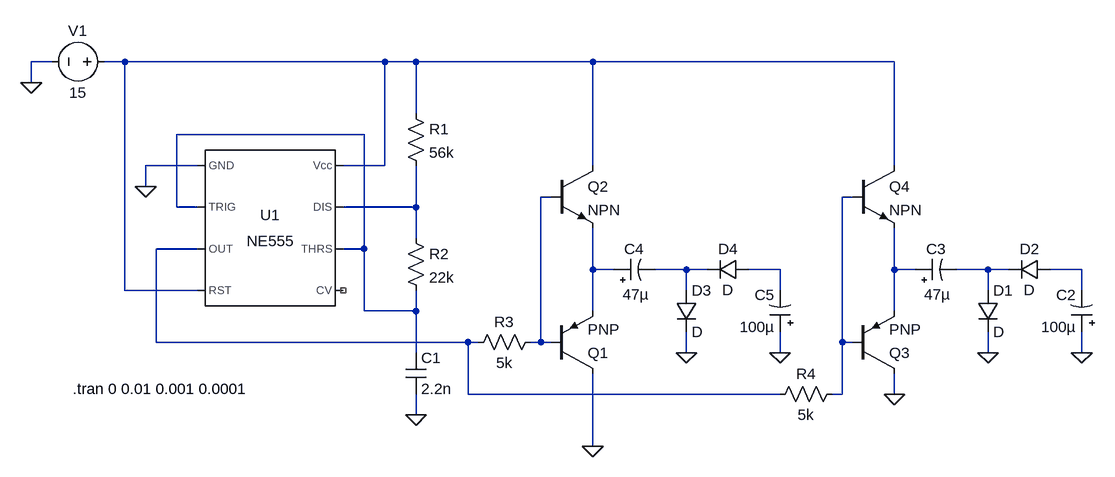
[diagram p0: schematic 555timer_voltageInerter_ChargePump_2.asc]
555timer_voltageInerter_ChargePump_2.asc, the LTspice schematic file:
Version 4
SHEET 1 1700 680
WIRE -224 -96 -256 -96
WIRE -112 -96 -144 -96
WIRE 288 -96 -112 -96
WIRE 336 -96 288 -96
WIRE 608 -96 336 -96
WIRE 1072 -96 608 -96
WIRE -256 -64 -256 -96
WIRE 336 -16 336 -96
WIRE 256 16 -32 16
WIRE 0 64 -80 64
WIRE 288 64 288 -96
WIRE 288 64 224 64
WIRE 608 64 608 -96
WIRE 1072 64 1072 -96
WIRE -80 96 -80 64
WIRE 544 112 528 112
WIRE 1008 112 992 112
WIRE -32 128 -32 16
WIRE 0 128 -32 128
WIRE 336 128 336 64
WIRE 336 128 224 128
WIRE 336 176 336 128
WIRE 0 192 -64 192
WIRE 256 192 256 16
WIRE 256 192 224 192
WIRE 608 224 608 160
WIRE 640 224 608 224
WIRE 752 224 704 224
WIRE 784 224 752 224
WIRE 896 224 848 224
WIRE 1072 224 1072 160
WIRE 1104 224 1072 224
WIRE 1216 224 1168 224
WIRE 1248 224 1216 224
WIRE 1360 224 1312 224
WIRE -112 256 -112 -96
WIRE 0 256 -112 256
WIRE 752 256 752 224
WIRE 896 256 896 224
WIRE 1216 256 1216 224
WIRE 1360 256 1360 224
WIRE 256 288 256 192
WIRE 336 288 336 256
WIRE 336 288 256 288
WIRE 608 288 608 224
WIRE 1072 288 1072 224
WIRE -64 336 -64 192
WIRE 416 336 -64 336
WIRE 432 336 416 336
WIRE 528 336 528 112
WIRE 528 336 512 336
WIRE 544 336 528 336
WIRE 992 336 992 112
WIRE 1008 336 992 336
WIRE 336 352 336 288
WIRE 752 352 752 320
WIRE 896 352 896 320
WIRE 1216 352 1216 320
WIRE 1360 352 1360 320
WIRE 416 416 416 336
WIRE 896 416 416 416
WIRE 992 416 992 336
WIRE 992 416 976 416
WIRE 1072 416 1072 384
WIRE 336 448 336 416
WIRE 608 496 608 384
FLAG -80 96 0
FLAG -256 -64 0
FLAG 336 448 0
FLAG 1216 352 0
FLAG 1360 352 0
FLAG 752 352 0
FLAG 896 352 0
FLAG 608 496 0
FLAG 1072 416 0
SYMBOL Misc\\NE555 112 160 R0
SYMATTR InstName U1
SYMBOL voltage -128 -96 R90
WINDOW 0 -32 56 VBottom 2
WINDOW 3 32 56 VTop 2
WINDOW 123 0 0 Left 2
WINDOW 39 0 0 Left 2
SYMATTR InstName V1
SYMATTR Value 15
SYMBOL res 320 -32 R0
SYMATTR InstName R1
SYMATTR Value 56k
SYMBOL res 320 160 R0
SYMATTR InstName R2
SYMATTR Value 22k
SYMBOL cap 320 352 R0
SYMATTR InstName C1
SYMATTR Value 2.2n
SYMBOL polcap 1104 240 R270
WINDOW 0 32 32 VTop 2
WINDOW 3 -7 34 VBottom 2
SYMATTR InstName C3
SYMATTR Value 47µ
SYMATTR Description Capacitor
SYMATTR Type cap
SYMATTR SpiceLine V=25 Irms=210m Rser=0.55 Lser=0
SYMBOL diode 1200 256 R0
SYMATTR InstName D1
SYMBOL diode 1312 208 R90
WINDOW 0 0 32 VBottom 2
WINDOW 3 32 32 VTop 2
SYMATTR InstName D2
SYMBOL polcap 1376 320 R180
WINDOW 0 24 57 Left 2
WINDOW 3 24 8 Left 2
SYMATTR InstName C2
SYMATTR Value 100µ
SYMATTR Description Capacitor
SYMATTR Type cap
SYMATTR SpiceLine V=50 Irms=170m Rser=1 Lser=0
SYMBOL polcap 640 240 R270
WINDOW 0 32 32 VTop 2
WINDOW 3 -7 34 VBottom 2
SYMATTR InstName C4
SYMATTR Value 47µ
SYMATTR Description Capacitor
SYMATTR Type cap
SYMATTR SpiceLine V=25 Irms=210m Rser=0.55 Lser=0
SYMBOL diode 736 256 R0
SYMATTR InstName D3
SYMBOL diode 848 208 R90
WINDOW 0 0 32 VBottom 2
WINDOW 3 32 32 VTop 2
SYMATTR InstName D4
SYMBOL polcap 912 320 R180
WINDOW 0 24 57 Left 2
WINDOW 3 24 8 Left 2
SYMATTR InstName C5
SYMATTR Value 100µ
SYMATTR Description Capacitor
SYMATTR Type cap
SYMATTR SpiceLine V=50 Irms=170m Rser=1 Lser=0
SYMBOL pnp 544 384 M180
SYMATTR InstName Q1
SYMBOL npn 544 64 R0
SYMATTR InstName Q2
SYMBOL pnp 1008 384 M180
SYMATTR InstName Q3
SYMBOL npn 1008 64 R0
SYMATTR InstName Q4
SYMBOL res 528 320 R90
WINDOW 0 0 56 VBottom 2
WINDOW 3 32 56 VTop 2
SYMATTR InstName R3
SYMATTR Value 5k
SYMBOL res 992 400 R90
WINDOW 0 0 56 VBottom 2
WINDOW 3 32 56 VTop 2
SYMATTR InstName R4
SYMATTR Value 5k
TEXT -192 408 Left 2 !.tran 0 0.01 0.001 0.0001

The netlist it stands for:
* 555timer_voltageInerter_ChargePump_2.asc
XU1 0 N002 N006 N001 NC_01 N002 N005 N001 NE555  ; pins GND TRIG OUT RST CV THRS DIS Vcc
V1 N001 0 15
R1 N001 N005 56k
R2 N005 N002 22k
C1 N002 0 2.2n
C3 N010 N011 47µ V=25 Irms=210m Rser=0.55 Lser=0
D1 N011 0 D
D2 N012 N011 D
C2 0 N012 100µ V=50 Irms=170m Rser=1 Lser=0
C4 N007 N008 47µ V=25 Irms=210m Rser=0.55 Lser=0
D3 N008 0 D
D4 N009 N008 D
C5 0 N009 100µ V=50 Irms=170m Rser=1 Lser=0
Q1 0 N003 N007 0 PNP
Q2 N001 N003 N007 0 NPN
Q3 0 N004 N010 0 PNP
Q4 N001 N004 N010 0 NPN
R3 N003 N006 5k
R4 N004 N006 5k
.model D D
.lib standard.dio
.model NPN NPN
.model PNP PNP
.lib standard.bjt
.tran 0 0.01 0.001 0.0001
.lib NE555.sub
.backanno
.end